# Altium project Lion tracker.PrjPCB (part 2 of 4)

## Sheet GPS.SchDoc
size A3; DocumentNumber: 3; SheetNumber: 3; SheetTotal: 5
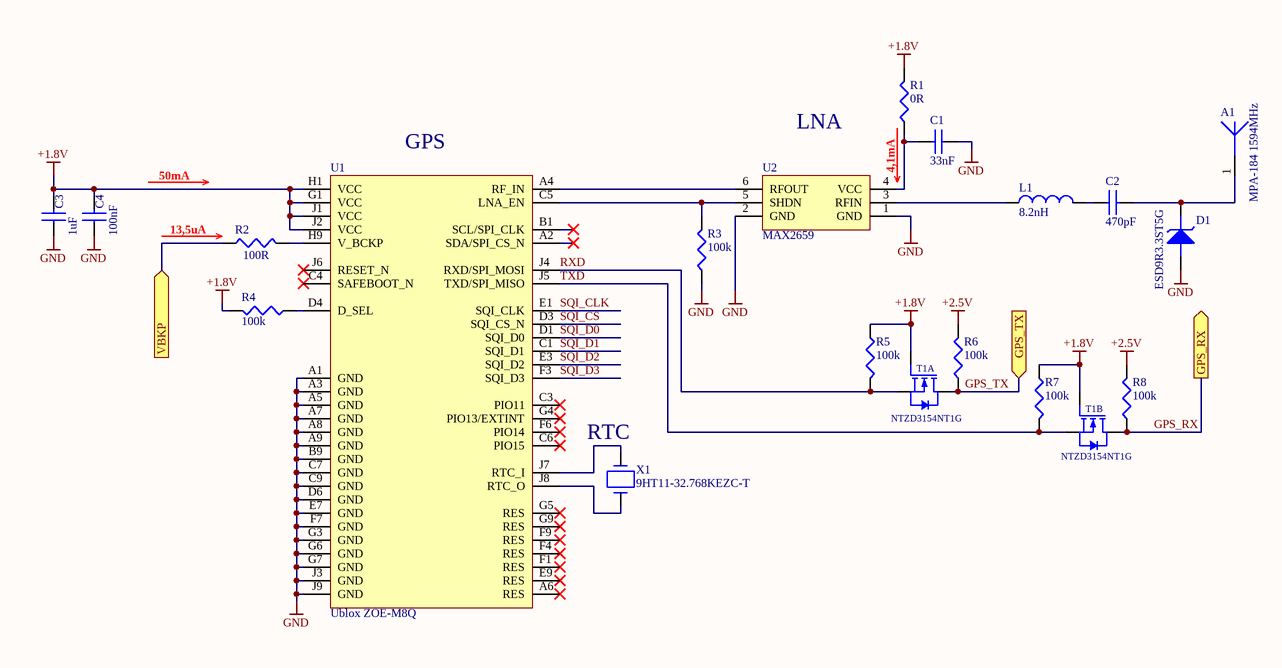
[diagram p3: GPS.SchDoc]

### Parts
A1  MPA-184 1594MHz  [MPA-184]
C1  33nF  [CAP0402]
C2  470pF  [CAP0402]
C3  1uF  [CAP0402]
C4  100nF  [CAP0402]
D1  ESD9R3.3ST5G  [SOD-923]
L1  8.2nH  [IND0402]
R1  0R  [RES0402]
R2  100R  [RES0402]
R3  100k  [RES0402]
R4  100k  [RES0402]
R5  100k  [RES0402]
R6  100k  [RES0402]
R7  100k  [RES0402]
R8  100k  [RES0402]
T1  NTZD3154NT1G  [SOT-563]  (parts A,B of 2)
U1  Ublox ZOE-M8Q  [S-LGA51]
U2  MAX2659  [uDFN-6]
X1  9HT11-32.768KEZC-T  [9HT11]

### Ports
GPS_RX (out), GPS_TX (in), VBKP (in)

### Nets
+1.8V: C3.2 C4.2 R1.2 R4.2 R5.1 R7.1 T1.2(G1) T1.5(G2) U1.G1(VCC) U1.H1(VCC) U1.J1(VCC) U1.J2(VCC)
+2.5V: R6.2 R8.2
GND: C1.1 C3.1 C4.1 D1.A(ANODE) R3.1 U1.A1(GND) U1.A3(GND) U1.A5(GND) U1.A7(GND) U1.A8(GND) U1.A9(GND) U1.B9(GND) U1.C7(GND) U1.C9(GND) U1.D6(GND) U1.E7(GND) U1.F7(GND) U1.G3(GND) U1.G6(GND) U1.G7(GND) U1.J3(GND) U1.J9(GND) U2.1(GND) U2.2(GND)
GPS_RX: R8.1 T1.3(D2) ; port GPS_RX
GPS_TX: R6.1 T1.6(D1) ; port GPS_TX
RXD: R5.2 T1.1(S1) U1.J4(RXD/SPI_MOSI)
SQI_CLK: U1.E1(SQI_CLK)
SQI_CS: U1.D3(SQI_CS_N)
SQI_D0: U1.D1(SQI_D0)
SQI_D1: U1.C1(SQI_D1)
SQI_D2: U1.E3(SQI_D2)
SQI_D3: U1.F3(SQI_D3)
TXD: R7.2 T1.4(S2) U1.J5(TXD/SPI_MISO)
VBKP: R2.1 ; port VBKP
NetA1_1: A1.1(ANT) C2.2 D1.K(cathode)
NetC1_2: C1.2 R1.1 U2.4(VCC)
NetC2_1: C2.1 L1.2
NetL1_1: L1.1 U2.3(RFIN)
NetR2_2: R2.2 U1.H9(V_BCKP)
NetR3_2: R3.2 U1.C5(LNA_EN) U2.5(SHDN)
NetR4_1: R4.1 U1.D4(D_SEL)
NetU1_A4: U1.A4(RF_IN) U2.6(RFOUT)
NetU1_J7: U1.J7(RTC_I) X1.2
NetU1_J8: U1.J8(RTC_O) X1.1

Not connected (* = marked no-connect by the designer): U1 A2(SDA/SPI_CS_N)* A6(RES)* B1(SCL/SPI_CLK)* C3(PIO11)* C4(SAFEBOOT_N)* C6(PIO15)* E9(RES)* F1(RES)* F4(RES)* F6(PIO14)* F9(RES)* G4(PIO13/EXTINT)* G5(RES)* G9(RES)* J6(RESET_N)*

### Notes on the sheet
- 50mA
- (near U1) GPS
- LNA
- 4,1mA
- (near R2) 13,5uA
- (near X1) RTC
- Size: A3
- Revision:
- Sheet
- of

### Library data of the parts
A1 = ANT - MAXTENA MPA-184 1594MHz: Antennas Passive GPS/GLONASS Patch Antenna; Manufacturer: Antenova; Manufacturer Part Number: SR42I010-R; Stock 1: 3154; Pricing 1: 1 = 2.36000, 10 = 1.90000, 50 = 1.90000, 100 = 1.52000, 1000 = 1.07000, 10000 = 0.95900 (USD); ComponentLink1Description: Datasheet; ComponentLink1URL: https://www.maxtena.com/wp-content/uploads/2018/09/maxtena_application_note_patch_antennas.pdf; Supplier 1: Digi-Key; Supplier Part Number 1: 931-1152-ND
C1 = C - 33pF/0402: 33 pF, 16 V,  5%, C0G / NP0, MC Series; Manufacturer: Multicomp; Manufacturer Part Number: MC0402N330J160CT; Capacitance: 33pF; Voltage Rating: 16V; Stock 1: 19597; Pricing 1: 10=0.011, 100=0.009, 500=0.0069, 2500=0.0041 (EUR); Case Code (Metric): 1005; Case Code (Imperial): 0402; Min Operating Temperature: -55°C; Max Operating Temperature: 125°C; Dielectric: C0G; Packaging: Cut Tape; Tolerance: 5%; Voltage Rating (DC): 16V; REACH SVHC: No SVHC; ComponentLink1URL: http://www.farnell.com/datasheets/2117933.pdf; ComponentLink1Description: http://www.farnell.com/datasheets/2117933.pdf; ComponentLink2URL: http://www.farnell.com/datasheets/2117900.pdf; ComponentLink2Description: http://www.farnell.com/datasheets/2117900.pdf; IRNAS Part No.: /; Supplier 1: Farnell; Supplier Part Number 1: 1759384
C2 = C - 470pF/0402: 470 pF, 50 V, 0402 [1005 Metric], ± 10%, X7R, GRT Series; Manufacturer: Murata; Manufacturer Part Number: GRT155R71H471KE01D; IRNAS Part No.: /; Stock 1: 11080; Pricing 1: 10=0.0259, 100=0.0176, 500=0.0105, 2500=0.008, 5000=0.007, 10000=0.006, 50000=0.0041 (GBP); Supplier 1: Farnell; Supplier Part Number 1: 2672128
C3 = C - 1uF/0402: CAP CER 1UF 10V 20% X5R 0402; Manufacturer: Murata; Manufacturer Part Number: GRM155R61A105ME15D; IRNAS Part No.: /; Stock 1: 0; Pricing 1: 10=0.0379, 100=0.0266, 500=0.0156, 2500=0.0098, 5000=0.0083 (EUR); Mount: Surface Mount; Case/Package: 0402; Case Code (Metric): 1005; Case Code (Imperial): 0402; Min Operating Temperature: -55°C; Max Operating Temperature: 85°C; Capacitance: 1uF; Tolerance: 20%; Voltage Rating: 10V; Packaging: Tape and Reel; Package Quantity: 1; Dielectric: X5R; Voltage: 10V; Voltage Rating (DC): 10V; Length: 1mm; Height: 0.5mm; Width: 0.02inch; Thickness: 0.022inch; Depth: 0.5mm; Radiation Hardening: No; REACH SVHC: No SVHC; Lead Free: Lead Free; ComponentLink1URL: https://datasheet.ciiva.com/164/product-164665.pdf; ComponentLink1Description: https://datasheet.ciiva.com/164/product-164665.pdf; ComponentLink2URL: https://datasheet.ciiva.com/11616/product-11616508.pdf; ComponentLink2Description: https://datasheet.ciiva.com/11616/product-11616508.pdf; ComponentLink3URL: https://datasheet.ciiva.com/46418/1769893-46418047.pdf; ComponentLink3Description: https://datasheet.ciiva.com/46418/1769893-46418047.pdf; ComponentLink4URL: https://datasheet.ciiva.com/164/partnumbering-e-01-164666.pdf; ComponentLink4Description: https://datasheet.ciiva.com/164/partnumbering-e-01-164666.pdf; ComponentLink5URL: https://datasheet.ciiva.com/164/partnumbering-e-01-164667.pdf; ComponentLink5Description: https://datasheet.ciiva.com/164/partnumbering-e-01-164667.pdf; Supplier 1: Farnell; Supplier Part Number 1: 1740588
C4 = C - 100nF/0402: 0.1 F, 16 V,  5%, X5R, MC Series; Manufacturer: Multicomp; Manufacturer Part Number: MC0402X104J160CT; IRNAS Part No.: /; Voltage Rating: 16V; Stock 1: 3230; Pricing 1: 10=0.0139, 100=0.0108, 500=0.0076, 2500=0.0051, 5000=0.0038 (EUR); Case Code (Metric): 1005; Case Code (Imperial): 0402; Min Operating Temperature: -55°C; Max Operating Temperature: 85°C; Capacitance: 100nF; Dielectric: X5R; Packaging: Tape and Reel; Tolerance: 5%; Voltage Rating (DC): 16V; REACH SVHC: No SVHC; ComponentLink1URL: http://www.farnell.com/datasheets/2117933.pdf; ComponentLink1Description: http://www.farnell.com/datasheets/2117933.pdf; ComponentLink2URL: http://www.farnell.com/datasheets/2117900.pdf; ComponentLink2Description: http://www.farnell.com/datasheets/2117900.pdf; Supplier 1: Farnell; Supplier Part Number 1: 2627419
D1 = D_TVS - ESD9R3.3ST5G: TVS Diode, ESD9R Series, Unidirectional, 3.3 V, 7.8 V; Manufacturer: DIODES INC.; Manufacturer Part Number: 1N4148W-7-F.; Diode Configuration: Single; Repetitive Reverse Voltage Vrrm Max: 100; Forward Current If(AV): 300; Forward Voltage VF Max: 1.25; Reverse Recovery Time trr Max: 4; Forward Surge Current Ifsm Max: 2; Diode Case Style: SOD-123; Product Range: 1N4148 Series; SVHC: No SVHC (17-Dec-2015); Diode Type: Switching; RoHS: YES; Stock 1: 157320; Pricing 1: 1=0.136, 25=0.132, 100=0.0465, 500=0.042, 1000=0.024, 3000=0.021, 9000=0.017, 30000=0.0149 (GBP); Operating Temperature Max: 150; No. of Pins: 2; Packaging: Cut Tape; Automotive Qualification Standard: -; MSL: MSL 1 - Unlimited; Operating Temperature Min: -65; Operating Temperature Range: -65°C to +150°C<!--FANDB--><div class="features-and-benefits-container"><div class="features-and-benefits-description"><span class="features-benefits-value">The 1N4148W-7-F is a surface mount fast Switching Diode with moulded plastic case. Suitable for general purpose switching applications.</span></div><div class="features-and-benefits-list"><ul class="features-and-benefits-list-list"><li class="features-and-benefits-list-item">Fast Switching Speed</li><li class="features-and-benefits-list-item">2; ComponentLink1URL: D:\altium\Altium_Library\Active\Datasheet\ESD9R33ST5G.pdf; ComponentLink1Description: Datasheet; Supplier 1: Farnell; Supplier Part Number 1: 2101835
L1 = L - 33nH/0402: High Frequency Inductor, 8.2 nH, LQG15HN Series, 300 mA, 0402 [1005 Metric], Multilayer, 0.33 ohm; Manufacturer: Murata; Manufacturer Part Number: LQG15HS33NJ02D; IRNAS Part No.: /; Core Material: Air; Tolerance: 5%; Q Factor: 8; Self Resonant Frequency: 1.6GHz; Current Rating: 200mA; Shielding: Unshielded; Inductance: 33nh; DC Resistance (DCR): 580mR; Test Frequency: 100MHz; Stock 1: 168013; Pricing 1: 1=0.1, 10=0.061, 100=0.0404, 500=0.0337, 1000=0.0283, 2500=0.0242 (USD); Mount: Surface Mount; Case/Package: 0402; Case Code (Metric): 1005; Case Code (Imperial): 0402; Min Operating Temperature: -55°C; Max Operating Temperature: 125°C; Package Quantity: 10000; Packaging: Tape and Reel; Max DC Current: 200mA; Termination: SMD/SMT; DC Current: 200mA; Military Standard: Not; Length: 1mm; Height: 0.5mm; Width: 0.5mm; Height - Seated (Max): 0.022inch; Depth: 0.55mm; Radiation Hardening: No; Lead Free: Lead Free; ComponentLink1URL: https://datasheet.ciiva.com/11799/0900766b8090d685-11799024.pdf; ComponentLink1Description: https://datasheet.ciiva.com/11799/0900766b8090d685-11799024.pdf; ComponentLink2URL: https://datasheet.ciiva.com/1038/l0075s0083lqg15hs-1038140.pdf; ComponentLink2Description: https://datasheet.ciiva.com/1038/l0075s0083lqg15hs-1038140.pdf; ComponentLink3URL: https://datasheet.ciiva.com/1038/l0075s0083lqg15hs-1038141.pdf; ComponentLink3Description: https://datasheet.ciiva.com/1038/l0075s0083lqg15hs-1038141.pdf; ComponentLink4URL: https://datasheet.ciiva.com/16207/l0075s0083lqg15hs-16207871.pdf; ComponentLink4Description: https://datasheet.ciiva.com/16207/l0075s0083lqg15hs-16207871.pdf; ComponentLink5URL: https://datasheet.ciiva.com/1038/l0075s0083lqg15hs-1038139.pdf; ComponentLink5Description: https://datasheet.ciiva.com/1038/l0075s0083lqg15hs-1038139.pdf; ComponentLink6URL: https://datasheet.ciiva.com/17279/l0075s0083lqg15hs-17279253.pdf; ComponentLink6Description: https://datasheet.ciiva.com/17279/l0075s0083lqg15hs-17279253.pdf; ComponentLink7URL: https://datasheet.ciiva.com/4977/o05e-4977560.pdf; ComponentLink7Description: https://datasheet.ciiva.com/4977/o05e-4977560.pdf; ComponentLink8URL: https://datasheet.ciiva.com/8510/l0075s0083lqg15hs-8510857.pdf; ComponentLink8Description: https://datasheet.ciiva.com/8510/l0075s0083lqg15hs-8510857.pdf; Supplier 1: Farnell; Supplier Part Number 1: 1343079
R1 = R - 0R/0402: RESISTOR, 0402, 0R, ANTI SULFURATION; Manufacturer: Multicomp; Manufacturer Part Number: MCMR04X000PTL; IRNAS Part No.: I-100016; Voltage Rating: 50V; Resistance: 0mR; Power Rating: 62.5mW; Temperature Coefficient: 400ppm/°C; Supplier 1: Farnell; Stock 1: 0; Pricing 1: 10=0.0057, 100=0.0034, 500=0.0024, 2500=0.0019, 5000=0.0015 (EUR); Case/Package: 0402; Case Code (Metric): 1005; Case Code (Imperial): 0402; Packaging: Cut Tape; Composition: Ceramic; Voltage Rating (DC): 50V; REACH SVHC: No SVHC; ComponentLink1URL: https://datasheet.ciiva.com/7776/1716705-7776974.pdf; ComponentLink1Description: https://datasheet.ciiva.com/7776/1716705-7776974.pdf; ComponentLink2URL: https://datasheet.ciiva.com/28677/1716705-28677161.pdf; ComponentLink2Description: https://datasheet.ciiva.com/28677/1716705-28677161.pdf; Supplier Part Number 1: 2072513
R2 = R - 100R/0402: 100 ohm, 50 V, 0402 [1005 Metric], 62.5 mW,  1%; Manufacturer: Multicomp; Manufacturer Part Number: MCMR04X1000FTL; IRNAS Part No.: /; Temperature Coefficient: 100ppm/°C; Power Rating: 62.5mW; Voltage Rating: 50V; Supplier 1: Farnell; Stock 1: 62365; Pricing 1: 10=0.0071, 100=0.0042, 500=0.003, 2500=0.0024, 5000=0.0019 (GBP); Case/Package: 0402; Case Code (Metric): 1005; Case Code (Imperial): 0402; Resistance: 100R; Tolerance: 1%; Composition: Ceramic; Packaging: Cut Tape; Voltage Rating (DC): 50V; REACH SVHC: No SVHC; ComponentLink1URL: https://datasheet.ciiva.com/28692/1716705-28692087.pdf; ComponentLink1Description: https://datasheet.ciiva.com/28692/1716705-28692087.pdf; ComponentLink2URL: https://datasheet.ciiva.com/22708/1716705-22708156.pdf; ComponentLink2Description: https://datasheet.ciiva.com/22708/1716705-22708156.pdf; Supplier Part Number 1: 2072515
R3-R8 = R - 100k/0402: 100KOHM, 1%, 0.0625W; Manufacturer: Multicomp; Manufacturer Part Number: MCWR04X1003FTL; IRNAS Part No.: I-100013; Resistance: 100kR; Power Rating: 62.5mW; Voltage Rating: 50V; Temperature Coefficient: 100ppm/°C; Supplier 1: Farnell; Stock 1: 161188; Pricing 1: 10=0.0029, 100=0.0017, 500=0.0012, 2500=0.001, 5000=0.0008 (EUR); Mount: Surface Mount; Case/Package: 0402; Case Code (Metric): 1005; Case Code (Imperial): 0402; Tolerance: 1%; Packaging: Cut Tape; Composition: Thick Film; Voltage Rating (DC): 50V; REACH SVHC: No SVHC; ComponentLink1URL: https://datasheet.ciiva.com/46386/1849611-46386524.pdf; ComponentLink1Description: https://datasheet.ciiva.com/46386/1849611-46386524.pdf; Supplier Part Number 1: 2447094
T1 = T_M - NTZD3154NT1G: Dual MOSFET, Dual N Channel, 540 mA, 20 V, 0.4 ohm, 4.5 V, 1 V; ELRAD Id sifra / ELRAD Id No: 597778; Opis / Description: MOSFET BSS123       /N-Channel; Komp / Device: SMD; Value: BSS123; Velikost / Size: SOT23; FIT: 0.44; Manufacturer Part Number: NTZD3154NT1G; Author: Ciril Golob; Date: 11.07.2018; ComponentLINK1Description: Datasheet; ComponentLINK2Description: Datasheet www; ComponentLINK1URL: c:\ELRADSVN\Altium_Library\Libraries\Active\Datasheet\BSS123.pdf; ComponentLINK2URL: http://www.onsemi.com/pub/Collateral/BSS123-D.PDF; Supplier 1: Farnell; Supplier Part Number 1: 2533209
U1 = RF - UBLOX-ZOE-M8B: ZOE-M8 RF Receiver BeiDou, Galileo, GLONASS, GNSS, GPS -160dBm; Manufacturer: u-blox; Manufacturer Part Number: MAX-M8Q-0; Stock 1: 10805; Supplier 1: Digi-Key; Supplier Part Number 1: 672-1063-1-ND
U2 = RF - MAX2659: RF Amplifier, GPS / GNSS, 20.5 dB Gain / 0.8 dB Noise, 1575.42 MHz, 1.6 V to 3.3 V Supply; Manufacturer: u-blox; Manufacturer Part Number: MAX-M8Q-0; Stock 1: 10805; ComponentLink1Description: Datasheet; ComponentLink1URL: D:\altium\Altium_Library\Active\Datasheet\MAX2659.pdf; Supplier 1: Farnell; Supplier Part Number 1: 2800966; Supplier 2: Mouser; Supplier Part Number 2: 700-MAX2659ELT+T
X1 = X - 9HT11-32.768KEZC-T: Crystal, 32.768 kHz, SMD, 2mm x 1.2mm, 9 pF, 10 ppm, 9HT11 Series; Manufacturer: IQD; Manufacturer Part Number: LFXTAL009678; IRNAS Part No.: /; Load Capacitance: 12.5pF; Frequency: 32.8kHz; Stock 1: 15609; Pricing 1: 5=0.283, 50=0.203, 250=0.169, 500=0.163, 1500=0.157, 3000=0.152, 15000=0.146 (EUR); Case/Package: 217; Number of Pins: 2; Min Operating Temperature: -40°C; Max Operating Temperature: 85°C; REACH SVHC: No SVHC; ComponentLink1URL: http://www.farnell.com/datasheets/1750031.pdf?_ga=2.80970644.2249963.1562564392-1373726713.1554121096&_gac=1.50020820.1562763802.CjwKCAjwmZbpBRAGEiwADrmVXm8xT8OHDZvJe8qZIQyyGmIuiUD-TEITatw0hIdDkyBwIXXCH7oneRoCl7cQAvD_BwE; ComponentLink1Description: Datasheet; Supplier 1: Farnell; Supplier Part Number 1: 2819312

## Sheet POWER.SchDoc
size A3; DocumentNumber: 4; SheetNumber: 4; SheetTotal: 5
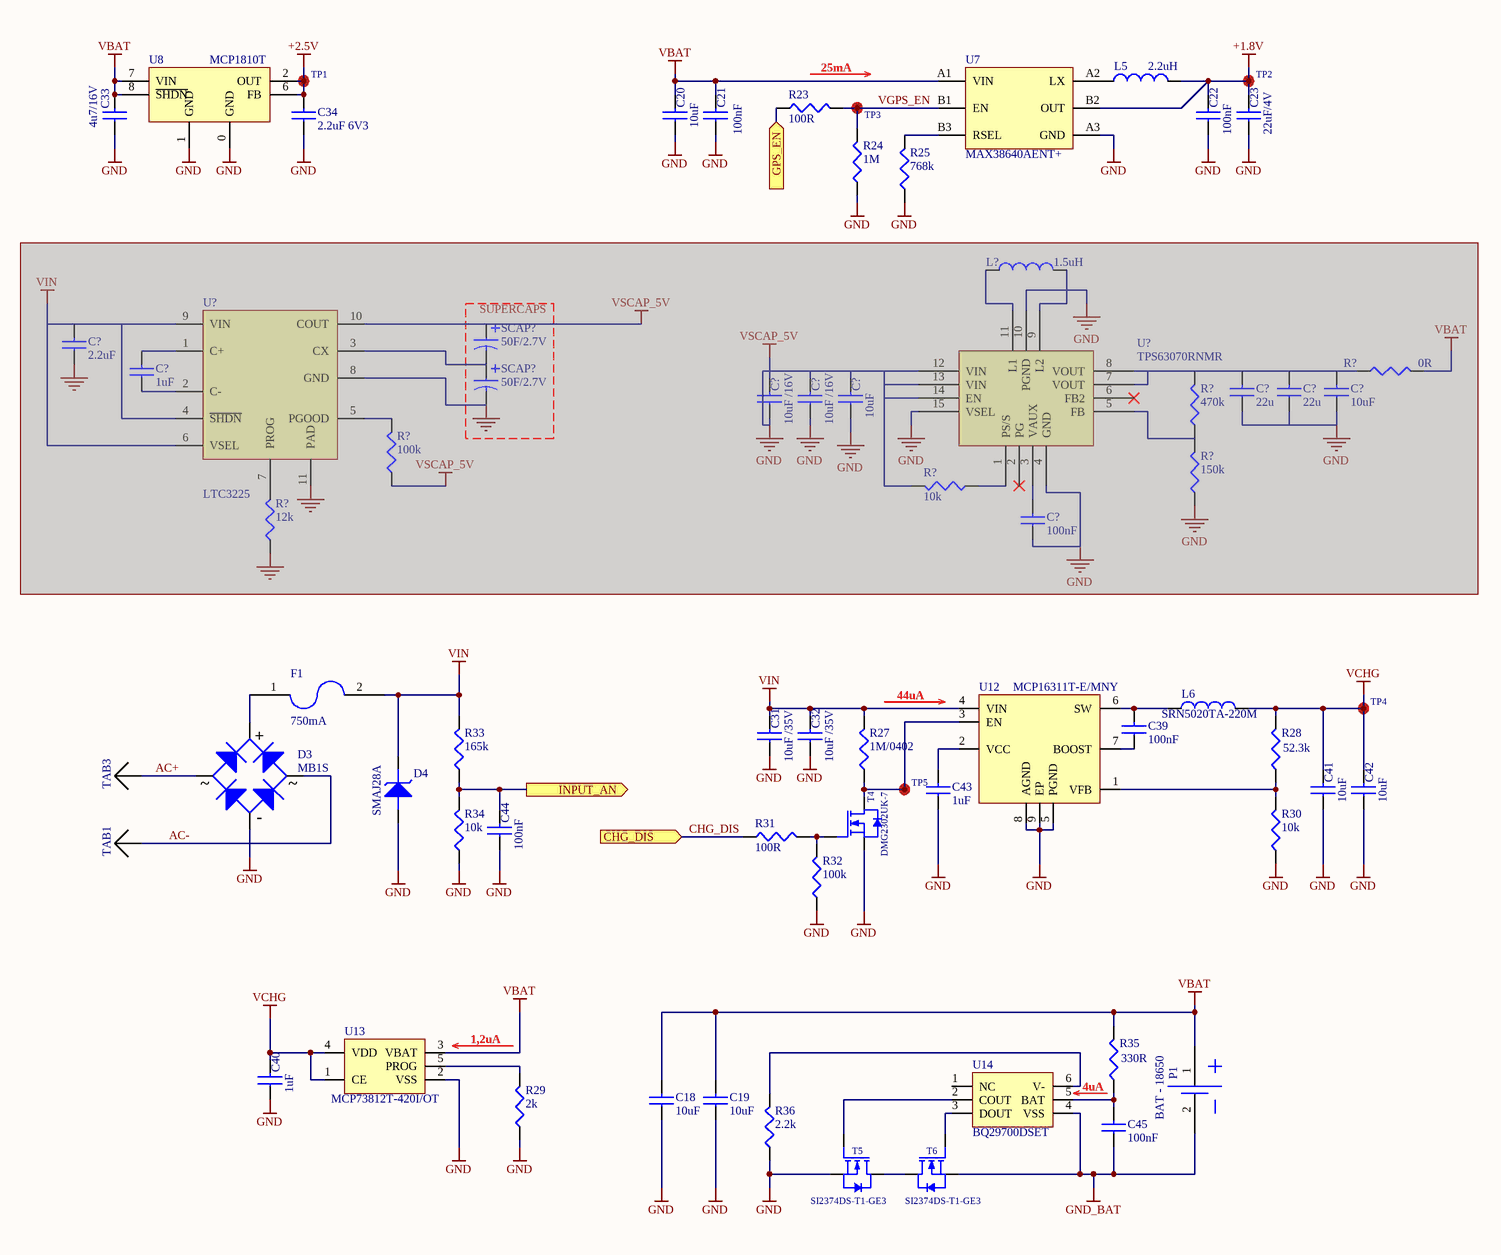
[diagram p4: POWER.SchDoc]

### Parts
(Parts that share a designator on the sheet are numbered #1, #2 ... from top to bottom, then left to right.)
C18  10uF  [CAP0603]
C19  10uF  [CAP0603]
C20  10uF  [CAP0603]
C21  100nF  [CAP0402]
C22  100nF  [CAP0402]
C23  22uF/4V  [CAP0603]
C31  10uF /35V  [CAP0805]
C32  10uF /35V  [CAP0805]
C33  4u7/16V  [CAP0603]
C34  2.2uF 6V3  [CAP0402]
C39  100nF  [CAP0402]
C40  1uF  [CAP0402]
C41  10uF  [CAP0603]
C42  10uF  [CAP0603]
C43  1uF  [CAP0402]
C44  100nF  [CAP0402]
C45  100nF  [CAP0402]
C?#1  2.2uF  [CAP0805]  (masked out: inside a compile mask, not in the netlist)
C?#2  1uF  [CAP0603]  (masked out: inside a compile mask, not in the netlist)
C?#3  10uF /16V  [CAP0805]  (masked out: inside a compile mask, not in the netlist)
C?#4  10uF /16V  [CAP0805]  (masked out: inside a compile mask, not in the netlist)
C?#5  22u  [CAP0805]  (masked out: inside a compile mask, not in the netlist)
C?#6  22u  [CAP0805]  (masked out: inside a compile mask, not in the netlist)
C?#7  10uF  [CAP0603]  (masked out: inside a compile mask, not in the netlist)
C?#8  10uF  [CAP0603]  (masked out: inside a compile mask, not in the netlist)
C?#9  100nF  [CAP0603]  (masked out: inside a compile mask, not in the netlist)
D3  MB1S  [MB1S]
D4  SMAJ28A  [DO-214AC (SMA)]
F1  750mA  [FUSE0603]
L5  2.2uH  [IND2.3X1.7]
L6  SRN5020TA-220M  [SRN5020TA]
L?  1.5uH  [FDSD0402]  (masked out: inside a compile mask, not in the netlist)
P1  BAT - 18650  [BATTERY 18650 - SMD TAB]
R23  100R  [RES0402]
R24  1M  [RES0402]
R25  768k  [RES0402]
R27  1M/0402  [RES0402]
R28  52.3k  [RES0402]
R29  2k  [RES0402]
R30  10k  [RES0402]
R31  100R  [RES0402]
R32  100k  [RES0402]
R33  165k  [RES0402]
R34  10k  [RES0402]
R35  330R  [RES0402]
R36  2.2k  [RES0402]
R?#1  0R  [RES0603]  (masked out: inside a compile mask, not in the netlist)
R?#2  470k  [RES0603]  (masked out: inside a compile mask, not in the netlist)
R?#3  100k  [RES0603]  (masked out: inside a compile mask, not in the netlist)
R?#4  150k  [RES0603]  (masked out: inside a compile mask, not in the netlist)
R?#5  10k  [RES0603]  (masked out: inside a compile mask, not in the netlist)
R?#6  12k  [RES0603]  (masked out: inside a compile mask, not in the netlist)
SCAP?#1  50F/2.7V  [Super Capacitor Horizontal]  (masked out: inside a compile mask, not in the netlist)
SCAP?#2  50F/2.7V  [Super Capacitor Horizontal]  (masked out: inside a compile mask, not in the netlist)
T4  DMG2302UK-7  [SOT23-3AL]
T5  SI2374DS-T1-GE3  [SOT23-3AL]
T6  SI2374DS-T1-GE3  [SOT23-3AL]
TAB1  WP-SMBU SMD  [WP-SMBU]  (value not drawn)
TAB3  WP-SMBU SMD  [WP-SMBU]  (value not drawn)
TP1  TestPoint  [TestPoint:1.2x1.2mm]  (value not drawn)
TP2  TestPoint  [TestPoint:1.2x1.2mm]  (value not drawn)
TP3  TestPoint  [TestPoint:1.2x1.2mm]  (value not drawn)
TP4  TestPoint  [TestPoint:1.2x1.2mm]  (value not drawn)
TP5  TestPoint  [TestPoint:1.2x1.2mm]  (value not drawn)
U7  MAX38640AENT+  [WLP-6]
U8  MCP1810T  [VDFN_2x2]
U12  MCP16311T-E/MNY  [TDFN-8]
U13  MCP73812T-420I/OT  [SOT23-5]
U14  BQ29700DSET  [PWSON-6]
U?#1  LTC3225  [PSON50P200X80_HS-11N]  (masked out: inside a compile mask, not in the netlist)
U?#2  TPS63070RNMR  [VQFN TPS]  (masked out: inside a compile mask, not in the netlist)

### Blocks framed on the sheet
SUPERCAPS: SCAP?#1 SCAP?#2

### Ports
CHG_DIS (in), GPS_EN (in), INPUT_AN (out)

### Nets
+1.8V: C22.2 C23.2 L5.2 TP2.0 U7.B2(OUT)
+2.5V: C34.2 TP1.0 U8.2(OUT) U8.6(FB)
GND: C18.1 C19.1 C20.1 C21.1 C22.1 C23.1 C31.1 C32.1 C33.1 C34.1 C40.1 C41.1 C42.1 C43.1 C44.1 D3.2(cathode) D4.A(ANODE) R24.1 R25.1 R29.1 R30.1 R32.1 R34.1 R36.1 T4.2(S) T5.2(S) U7.A3(GND) U8.0(GND) U8.1(GND) U12.5(PGND) U12.8(AGND) U12.9(EP) U13.2(VSS)
GND_BAT: C45.1 P1.2 T6.2(S) U14.4(VSS)
VBAT: C18.2 C19.2 C20.2 C21.2 C33.2 P1.1 R35.2 U7.A1(VIN) U8.7(VIN) U8.8(~{SHDN}) U13.3(VBAT)
VCHG: C40.2 C41.2 C42.2 L6.2 R28.2 TP4.0 U13.1(CE) U13.4(VDD)
VIN: C31.2 C32.2 D4.K(cathode) F1.2 R27.2 R33.2 U12.4(VIN)
AC+: D3.4(cathode) TAB3.1(ALERT)
AC-: D3.3(cathode) TAB1.1(ALERT)
CHG_DIS: R31.1 ; port CHG_DIS
GPS_EN: R23.1 ; port GPS_EN
INPUT_AN: C44.2 R33.1 R34.2 ; port INPUT_AN
VGPS_EN: R23.2 R24.2 TP3.0 U7.B1(EN)
NetC39_1: C39.1 U12.7(BOOST)
NetC39_2: C39.2 L6.1 U12.6(SW)
NetC43_2: C43.2 U12.2(VCC)
NetC45_2: C45.2 R35.1 U14.5(BAT)
NetD3_1: D3.1(cathode) F1.1
NetL5_1: L5.1 U7.A2(LX)
NetR25_2: R25.2 U7.B3(RSEL)
NetR27_1: R27.1 T4.3(D) TP5.0 U12.3(EN)
NetR28_1: R28.1 R30.2 U12.1(VFB)
NetR29_2: R29.2 U13.5(PROG)
NetR31_2: R31.2 R32.2 T4.1(G)
NetR36_2: R36.2 U14.6(V-)
NetT5_1: T5.1(G) U14.2(COUT)
NetT5_3: T5.3(D) T6.3(D)
NetT6_1: T6.1(G) U14.3(DOUT)

Not connected (* = marked no-connect by the designer): U14 1(NC)

### Notes on the sheet
- 25mA
- 44uA
- 1,2uA
- (near R35) 4uA
- Size: A3
- Revision:
- Sheet
- of
- (in symbol D_GREZ - MB1S) +; ~